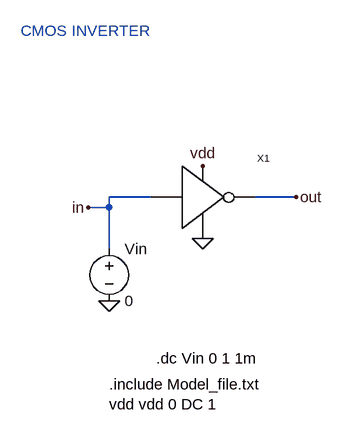
[diagram p0: schematic invertersim.asc]
invertersim.asc, the LTspice schematic file:
Version 4
SHEET 1 880 680
WIRE 128 96 64 96
WIRE 352 96 288 96
WIRE 64 112 64 96
WIRE 64 112 32 112
WIRE 64 176 64 112
FLAG 32 112 in
FLAG 352 96 out
FLAG 64 256 0
FLAG 208 160 0
FLAG 208 48 vdd
SYMBOL voltage 64 160 R0
WINDOW 123 0 0 Left 0
WINDOW 39 0 0 Left 0
SYMATTR InstName Vin
SYMATTR Value 0
SYMBOL Inverter 176 96 R0
SYMATTR InstName X1
TEXT 64 384 Left 2 !.include Model_file.txt\nvdd vdd 0 DC 1
TEXT -72 -160 Left 2 ;CMOS INVERTER
TEXT 136 344 Left 2 !.dc Vin 0 1 1m

The netlist it stands for:
* invertersim.asc
Vin in 0 0
XX1 in out vdd 0 Inverter  ; pins in out vdd DGND
.include Model_file.txt
vdd vdd 0 DC 1
* CMOS INVERTER
.dc Vin 0 1 1m
.backanno
.end